# EasyEDA Pro project Lib.epro

# Board Lib
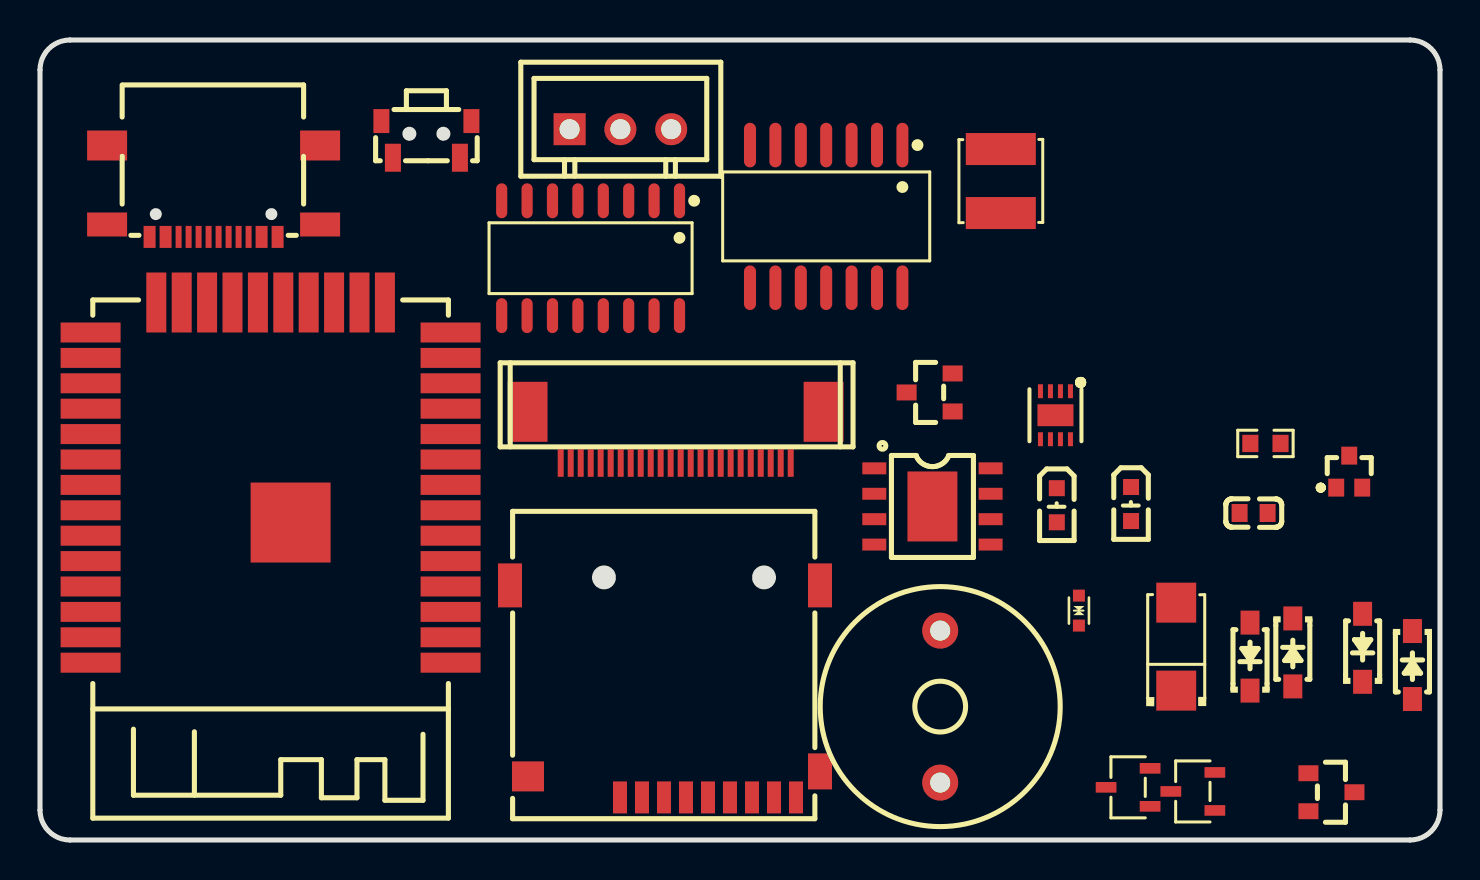
[diagram p0: board, top side]
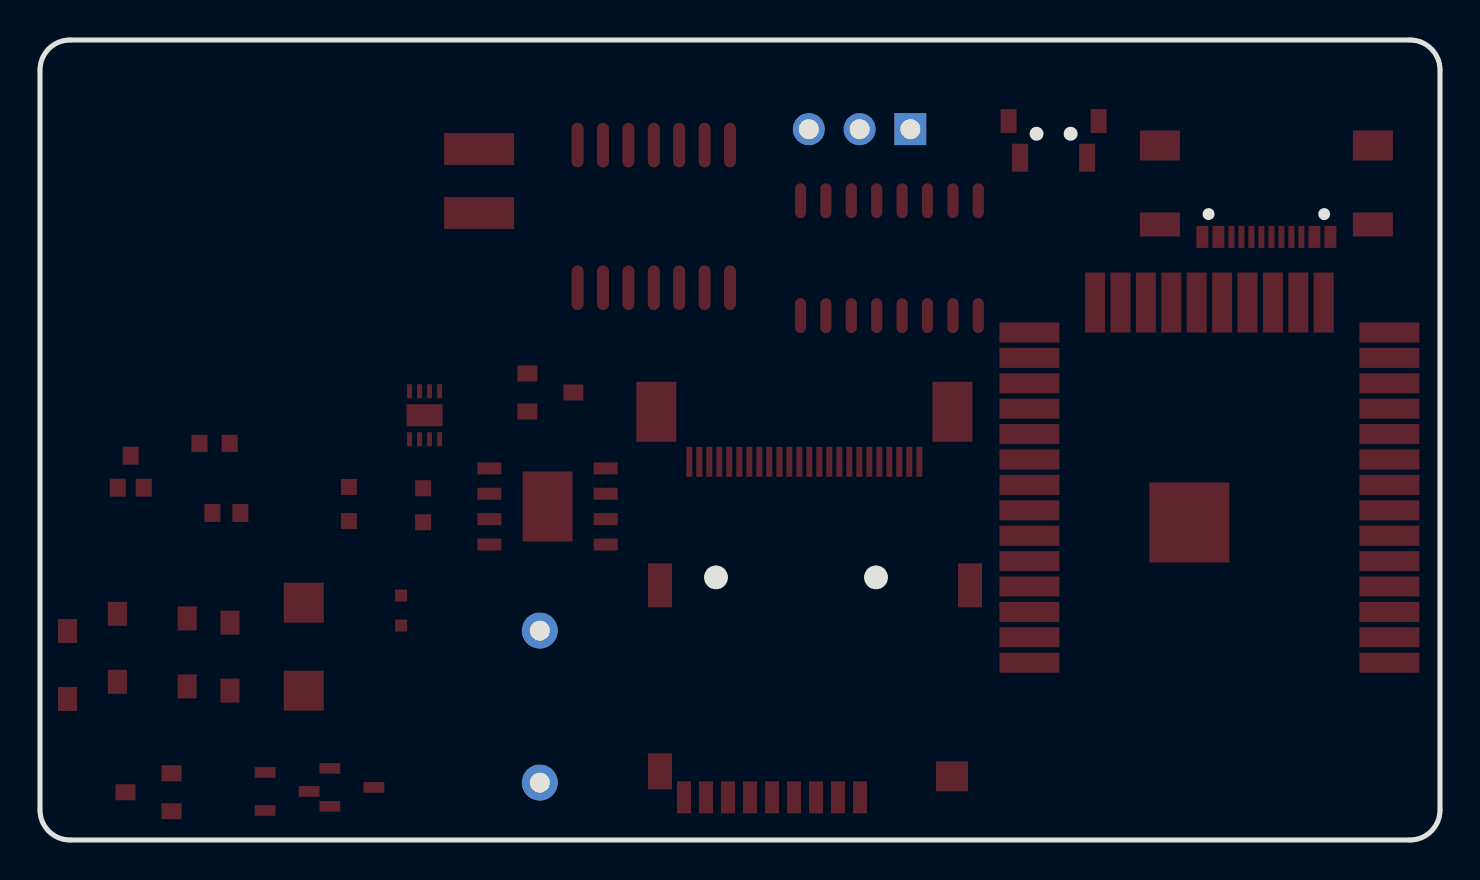
[diagram p1: board, bottom side, seen from below]

Outline 70 x 40 mm; copper layers: Top Layer, Bottom Layer. Coordinates in mm from the lower left corner of the outline.
Outline path: 0,38.5 0,1.5 arc(0.44,0.44) 1.5,0 68.5,0 arc(69.56,0.44) 70,1.5 70,38.5 arc(69.56,39.56) 68.5,40 1.5,40 arc(0.44,39.56) 0,38.5
Stack: Top Layer 0.035mm / Dielectric1 1.51mm FR4 er 4.5 / Bottom Layer 0.035mm

## Design rules (mm)
template: JLCPCB Capability(Two Layers Board)
spacing copperThickness1oz (default): track to track 0.102, other pairs 0.152 to 0.3
spacing copperThickness2oz: track to track 0.203, other pairs 0.152 to 0.3
track width copperThickness1oz (default): min 0.127, default 0.254, max 2.54
track width copperThickness2oz: min 0.203, default 0.254, max 2.54
differential pair differentialPair (default): width min 0.127, default 0.254, max 2.54; gap min 0.152, default 0.152
via viaSize (default): diameter min 0.5, default 0.61, max 10; hole min 0.3, default 0.305, max 6.3

## Placement (name value [footprint] x y rotation side)
BUZZER1  FMQ-BUZZER2  [BUZ-TH_BD12.0-P7.60-D0.6-FD]  45.01 6.67 270 top
C1  10uF  [C0603]  60.68 16.35 180 top
CARD1  -  [TF-SMD_THD2528-11SD-GF]  31.25 7.43 180 top
CHRG1  -  [LED0603-R-RD]  54.55 16.8 270 top
D1  -  [SOD-523_L1.2-W0.8-LS1.6-BI]  51.95 11.47 270 top
D4  -  [SMA_L4.3-W2.6-LS5.1-RD]  56.81 9.67 90 top
D5  -  [SOD-123_L2.7-W1.6-LS3.7-RD-1]  68.62 8.75 270 top
D6  -  [SOD-123_L2.7-W1.6-LS3.7-RD-1]  66.13 9.61 90 top
D7  -  [SOD-123_L2.7-W1.6-LS3.7-RD-1]  62.64 9.38 270 top
D8  -  [SOD-123_L2.7-W1.6-LS3.7-RD-1]  60.5 9.17 90 top
DONE1  -  [LED0603-R-RD]  50.84 16.74 270 top
FPC2  -  [FPC-SMD_24P-L17.5-W5.4-P0.50]  31.78 20.16 180 top
KEY3  -  [SW-SMD_L4.7-W3.5-P3.35-EH]  19.32 35.03 0 top
L1  68uH  [IND-SMD_L4.0-W4.0]  48.04 32.95 90 top
Q1  -  [SOT-23_L2.9-W1.3-P1.90-LS2.4-BR]  44.48 22.38 0 top
Q2  -  [SOT-23_L2.9-W1.3-P1.90-LS2.4-BR]  64.57 2.39 180 top
Q3  -  [SOT-323_L2.0-W1.3-P1.30-LS2.1-BR]  65.46 18.42 270 top
Q4  S8050  [SOT-23-3_L3.0-W1.7-P0.95-LS2.9-BR]  57.64 2.43 0 top
Q7  S8050-J3Y  [SOT-23-3_L3.0-W1.7-P0.95-LS2.9-BR]  54.41 2.63 0 top
R1  -  [R0603]  61.27 19.83 0 top
S1  SHT31  [DFN-8_L2.5-W2.5-P0.50-BL-EP]  50.77 21.24 180 top
U1  -  [ESOP-8_L4.9-W3.9-P1.27-LS6.0-BL-EP]  44.62 16.68 270 top
U4  -  [SOP-16_L10.0-W3.9-P1.27-LS6.0-BL]  27.53 29.09 180 top
U7  RX8025T  [SOIC-14_L10.0-W5.5-P1.27-LS7.8-BL]  39.31 31.18 180 top
U8  -  [WIRELM-SMD_ESP32-S]  11.53 17.87 180 top
U17  ZX-XH2.54-3PZZ  [CONN-TH_3P-P2.54_2501S-3P]  29.02 35.54 0 top
USB1  -  [USB-SMD_TYPE-611S-T3]  8.68 32.44 180 top

## Footprints (pads in the part's own frame, mm; a bottom-side part is the same pattern mirrored in y, then rotated)
BUZ-TH_BD12.0-P7.60-D0.6-FD
  round 1.8 hole 1: 1(-3.8,0) 2(3.8,0)
C0603
  rect 0.8x0.9 smd: 1(-0.7,0) 2(0.7,0)
CONN-TH_3P-P2.54_2501S-3P
  rect 1.6x1.6 hole 1: 1(-2.54,0)
  round 1.6 hole 1: 2(0,0) 3(2.54,0)
DFN-8_L2.5-W2.5-P0.50-BL-EP
  rect 0.25x0.7 smd: 1(-0.75,-1.2) 2(-0.25,-1.2) 3(0.25,-1.2) 4(0.75,-1.2) 5(0.75,1.2) 6(0.25,1.2) 7(-0.25,1.2) 8(-0.75,1.2)
  rect 1.8x1.1 smd: 9(0,0)
ESOP-8_L4.9-W3.9-P1.27-LS6.0-BL-EP
  rect 0.6x1.199 smd: 1(-1.905,-2.909) 2(-0.635,-2.909) 3(0.635,-2.909) 4(1.905,-2.909) 5(1.905,2.909) 6(0.635,2.909) 7(-0.635,2.909) 8(-1.905,2.909)
  rect 3.5x2.499 smd: 9(0,0)
FPC-SMD_24P-L17.5-W5.4-P0.50
  rect 0.299x1.501 smd: 1(5.745,1.25) 2(5.245,1.25) 3(4.745,1.25) 4(4.245,1.25) 5(3.747,1.25) 6(3.246,1.25) 7(2.745,1.25) 8(2.245,1.25) 9(1.745,1.25) 10(1.244,1.25) 11(0.747,1.25) 12(0.246,1.25) 13(-0.254,1.25) 14(-0.754,1.25) 15(-1.25,1.25) 16(-1.755,1.25) 17(-2.256,1.25) 18(-2.753,1.25) 19(-3.253,1.25) 20(-3.756,1.25) 21(-4.257,1.25) 22(-4.755,1.25) 23(-5.255,1.25) 24(-5.755,1.25)
  rect 1.999x2.999 smd: 25(-7.402,-1.25) 26(7.402,-1.25)
IND-SMD_L4.0-W4.0
  rect 1.6x3.5 smd: 1(-1.6,0) 2(1.6,0)
LED0603-R-RD
  rect 0.8x0.8 smd: 1(0.851,0) 2(-0.851,0)
R0603
  rect 0.807x0.864 smd: 1(-0.754,0) 2(0.754,0)
SMA_L4.3-W2.6-LS5.1-RD
  rect 1.999x1.999 smd: 1(-2.2,0) 2(2.2,0)
SOD-123_L2.7-W1.6-LS3.7-RD-1
  rect 1.199x0.95 smd: 1(-1.7,0) 2(1.7,0)
SOD-523_L1.2-W0.8-LS1.6-BI
  rect 0.6x0.6 smd: 1(-0.75,0) 2(0.75,0)
SOIC-14_L10.0-W5.5-P1.27-LS7.8-BL
  oval 0.602x2.23 smd: 1(-3.81,-3.566) 2(-2.54,-3.566) 3(-1.27,-3.566) 4(0,-3.566) 5(1.27,-3.566) 6(2.54,-3.566) 7(3.81,-3.566) 8(3.81,3.566) 9(2.54,3.566) 10(1.27,3.566) 11(0,3.566) 12(-1.27,3.566) 13(-2.54,3.566) 14(-3.81,3.566)
SOP-16_L10.0-W3.9-P1.27-LS6.0-BL
  oval 0.559x1.745 smd: 1(-4.445,-2.873) 2(-3.175,-2.873) 3(-1.905,-2.873) 4(-0.635,-2.873) 5(0.635,-2.873) 6(1.905,-2.873) 7(3.175,-2.873) 8(4.445,-2.873) 9(4.445,2.873) 10(3.175,2.873) 11(1.905,2.873) 12(0.635,2.873) 13(-0.635,2.873) 14(-1.905,2.873) 15(-3.175,2.873) 16(-4.445,2.873)
SOT-23-3_L3.0-W1.7-P0.95-LS2.9-BR
  rect 1.038x0.532 smd: 1(1.101,-0.95) 2(1.101,0.95) 3(-1.101,0)
SOT-23_L2.9-W1.3-P1.90-LS2.4-BR
  rect 1.001x0.8 smd: 1(1.151,-0.95) 2(1.151,0.95) 3(-1.151,0)
SOT-323_L2.0-W1.3-P1.30-LS2.1-BR
  rect 0.899x0.8 smd: 1(0.8,-0.65) 2(0.8,0.65) 3(-0.8,0)
SW-SMD_L4.7-W3.5-P3.35-EH
  rect 0.8x1.399 smd: 1(-1.674,-0.917) 2(1.677,-0.917)
  rect 0.8x1.199 smd: 3(-2.251,0.917) 4(2.251,0.917)
TF-SMD_THD2528-11SD-GF
  rect 0.701x1.6 smd: 1(2.251,5.301) 2(1.151,5.301) 3(0.051,5.301) 4(-1.049,5.301) 5(-2.149,5.301) 6(-3.248,5.301) 7(-4.351,5.301) 8(-5.451,5.301) 9(-6.551,5.301)
  rect 1.199x1.801 smd: 10(-7.75,4)
  rect 1.199x2.2 smd: 11(-7.75,-5.301) 12(7.75,-5.301)
  rect 1.6x1.501 smd: 13(6.851,4.25)
USB-SMD_TYPE-611S-T3
  rect 2x1.2 smd: 1(-5.325,1.665) 2(5.325,1.665)
  rect 2x1.5 smd: 3(5.325,-2.285) 4(-5.325,-2.285)
  rect 0.6x1.1 smd: A1B12(-3.2,2.285) A4B9(-2.4,2.285) B1A12(3.2,2.285) B4A9(2.4,2.285)
  rect 0.3x1.1 smd: A5(-1.25,2.285) A6(-0.25,2.285) A7(0.25,2.285) A8(1.25,2.285) B5(1.75,2.285) B6(0.75,2.285) B7(-0.75,2.285) B8(-1.75,2.285)
WIRELM-SMD_ESP32-S
  rect 2.999x1.001 smd: 1(-8.999,9.005) 2(-8.999,7.734) 3(-8.999,6.465) 4(-8.999,5.194) 5(-8.999,3.925) 6(-8.999,2.655) 7(-8.999,1.385) 8(-8.999,0.115) 9(-8.999,-1.155) 10(-8.999,-2.425) 11(-8.999,-3.696) 12(-8.999,-4.965) 13(-8.999,-6.236) 14(-8.999,-7.505) 25(8.999,-7.505) 26(8.999,-6.236) 27(8.999,-4.965) 28(8.999,-3.696) 29(8.999,-2.425) 30(8.999,-1.155) 31(8.999,0.115) 32(8.999,1.385) 33(8.999,2.655) 34(8.999,3.925) 35(8.999,5.194) 36(8.999,6.465) 37(8.999,7.734) 38(8.999,9.005)
  rect 1.001x2.999 smd: 15(-5.715,-9.005) 16(-4.445,-9.005) 17(-3.175,-9.005) 18(-1.905,-9.005) 19(-0.635,-9.005) 20(0.635,-9.005) 21(1.905,-9.005) 22(3.175,-9.005) 23(4.445,-9.005) 24(5.715,-9.005)
  rect 4x4 smd: 39(-1.001,1.996)

## Nets
3.3V: L1.1
3V3: CARD1.4 S1.5 U4.4 U4.16 U8.2
+5V: C1.2 D1.2 D4.2 Q1.1 Q2.1 U1.4 U1.8 USB1.A4B9 USB1.B4A9
GND: C1.1 CARD1.6 CARD1.10 CARD1.11 CARD1.12 CARD1.13 D1.1 D6.1 FPC2.8 FPC2.17 FPC2.25 FPC2.26 KEY3.1 KEY3.3 KEY3.4 Q2.2 Q7.2 R1.1 S1.2 S1.7 S1.8 S1.9 U1.1 U1.3 U1.9 U7.7 U7.11 U8.1 U8.15 U8.38 U8.39 U17.1 U17.2 USB1.1 USB1.2 USB1.3 USB1.4 USB1.A1B12 USB1.B1A12
VCC: FPC2.15 FPC2.16
BAT: D5.2 Q1.3 U1.5 U17.3
BUSY: FPC2.9 U8.26
BUZZER: U8.10
CS: FPC2.12 U8.29
D+: U4.5 USB1.A6 USB1.B6
D-: U4.6 USB1.A7 USB1.B7
DC: FPC2.11 U8.28
DIN: CARD1.3 FPC2.14 U8.37
GDR: FPC2.2 Q3.1
I2C_SCL: S1.4 U7.2 U8.36
I2C_SDA: S1.1 U7.13 U8.33
IO0: Q4.3 U8.25
KEY1: U8.9
KEY2: U8.11
KEY3: KEY3.2 U8.12
MISO: CARD1.7 U8.31
PREVGH: D8.1 FPC2.21
PREVGL: D7.2 FPC2.23
RESE: FPC2.3 Q3.2
REST: FPC2.10 U8.27
RTS: U8.3
RXD0: U4.2 U8.34
SCLK: CARD1.5 FPC2.13 U8.30
SD_SS: CARD1.2 U8.23
TXD0: U4.3 U8.35
$1N1008: FPC2.4
$1N1009: FPC2.5
$1N1010: FPC2.24
$1N1013: FPC2.22
$1N1016: FPC2.20
$1N1017: FPC2.18
$1N1018: FPC2.19
$1N1037: D8.2 L1.2 Q3.3
$1N1038: D6.2 D7.1
$1N3398: U1.2
$1N3399: CHRG1.1 DONE1.1
$1N3400: DONE1.2 U1.6
$1N3401: CHRG1.2 U1.7
$1N3410: R1.2 USB1.A5 USB1.B5
$1N4072: Q2.3 U4.1
$1N4223: U4.14
$1N4331: D4.1 Q1.2
$1N4928: D5.1 U7.6
$1N5158: Q4.1
$1N5192: Q4.2 U4.13
$1N5475: BUZZER1.2 Q7.3
$1N5476: Q7.1
$1N5477: BUZZER1.1

Pads without a net: CARD1 1 8 9; FPC2 1 6 7; S1 3 6; U4 7 8 9 10 11 12 15; U7 1 3 4 5 8 9 10 12 14; U8 4 5 6 7 8 13 14 16 17 18 19 20 21 22 24 32; USB1 A8 B8
